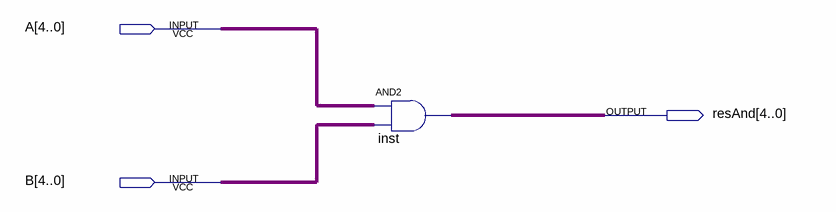
[diagram p0: schematic sheet]
// Quartus schematic A_and_B.bdf as structural Verilog: 1 symbols, 3 pins
module A_and_B (
  input  [4:0] A,
  input  [4:0] B,
  output [4:0] resAnd
);

  assign resAnd = A & B;  // AND2 inst, 5 bits wide
endmodule
